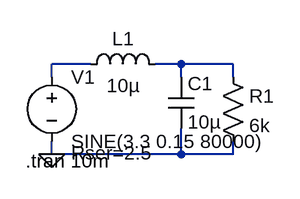
[diagram p0: schematic adcref.asc]
adcref.asc, the LTspice schematic file:
Version 4
SHEET 1 880 680
WIRE 96 112 48 112
WIRE 208 112 176 112
WIRE 272 112 208 112
WIRE 48 128 48 112
WIRE 208 128 208 112
WIRE 272 128 272 112
WIRE 48 224 48 208
WIRE 208 224 208 192
WIRE 208 224 48 224
WIRE 272 224 272 208
WIRE 272 224 208 224
FLAG 48 224 0
SYMBOL res 256 112 R0
SYMATTR InstName R1
SYMATTR Value 6k
SYMBOL cap 192 128 R0
SYMATTR InstName C1
SYMATTR Value 10µ
SYMBOL ind 80 128 R270
WINDOW 0 32 56 VTop 2
WINDOW 3 5 56 VBottom 2
SYMATTR InstName L1
SYMATTR Value 10µ
SYMBOL voltage 48 112 R0
WINDOW 123 0 0 Left 0
WINDOW 39 24 110 Left 2
SYMATTR SpiceLine Rser=2.5
SYMATTR InstName V1
SYMATTR Value SINE(3.3 0.15 80000)
TEXT 16 232 Left 2 !.tran 10m

The netlist it stands for:
* adcref.asc
R1 N002 0 6k
C1 N002 0 10µ
L1 N001 N002 10µ
V1 N001 0 SINE(3.3 0.15 80000) Rser=2.5
.tran 10m
.backanno
.end